# Altium schematic sheet Sheet1.SchDoc
size A4
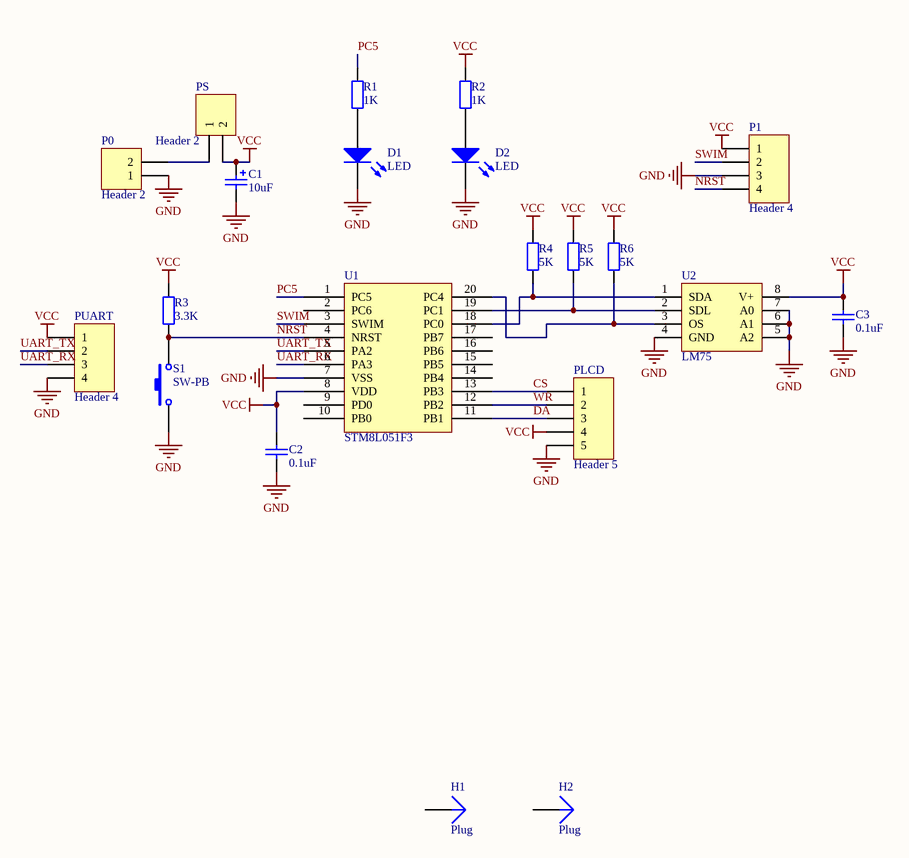
[diagram p0: Sheet1.SchDoc]

## Parts
C1  value 10uF  [CapPol5_11]  (hidden comment: Cap Pol2)
C2  value 0.1uF  [0603_LMH]  (hidden comment: Cap)
C3  value 0.1uF  [0603_LMH]  (hidden comment: Cap)
D1  LED  [0603_LMH]
D2  LED  [0603_LMH]
H1  Plug  [OriginHole]
H2  Plug  [OriginHole]
P0  Header 2  [KF350-2P]
P1  Header 4  [HDR1X4]
PLCD  Header 5  [HDR1X5]
PS  Header 2  [HDR1X2]
PUART  Header 4  [HDR1X4]
R1  value 1K  [0805]  (hidden comment: Res2)
R2  value 1K  [0805]  (hidden comment: Res2)
R3  value 3.3K  [0805]  (hidden comment: Res2)
R4  value 5K  [0805]  (hidden comment: Res2)
R5  value 5K  [0805]  (hidden comment: Res2)
R6  value 5K  [0805]  (hidden comment: Res2)
S1  SW-PB  [SW-3X6X2.5]
U1  STM8L051F3  [TSSOP20]
U2  LM75  [SOP8]

## Nets
GND: C1.2 C2.1 C3.1 D1.2(K) D2.2(K) P0.1 P1.3 PLCD.5 PUART.4 S1.1 U1.7(VSS) U2.4(GND) U2.5(A2) U2.6(A1) U2.7(A0)
VCC: C1.1 C2.2 C3.2 P1.1 PLCD.4 PS.2 PUART.1 R2.2 R3.2 R4.2 R5.2 R6.2 U1.8(VDD) U2.8(V+)
CS: PLCD.1 U1.13(PB3)
DA: PLCD.3 U1.11(PB1)
NRST: P1.4 R3.1 S1.2 U1.4(NRST)
PC5: R1.2 U1.1(PC5)
SWIM: P1.2 U1.3(SWIM)
UART_RX: PUART.3 U1.6(PA3)
UART_TX: PUART.2 U1.5(PA2)
WR: PLCD.2 U1.12(PB2)
NetD1_1: D1.1(A) R1.1
NetD2_1: D2.1(A) R2.1
NetP0_2: P0.2 PS.1
NetR4_1: R4.1 U1.18(PC0) U2.1(SDA)
NetR5_1: R5.1 U1.19(PC1) U2.2(SDL)
NetR6_1: R6.1 U1.20(PC4) U2.3(OS)

Not connected (* = marked no-connect by the designer): H1 1; H2 1; U1 2(PC6) 9(PD0) 10(PB0) 14(PB4) 15(PB5) 16(PB6) 17(PB7)

## Library data of the parts
C1 = Cap Pol2: Polarized Capacitor (Axial); Published: 8-Jun-2000; LatestRevisionDate: 17-Jul-2002; LatestRevisionNote: Re-released for DXP Platform.; PackageReference: POLAR0.8; Publisher: Altium Limited; PackageDescription: Polarized Capacitor; 2 Leads
C2 C3 = Cap: Capacitor; Published: 8-Jun-2000; LatestRevisionDate: 17-Jul-2002; LatestRevisionNote: Re-released for DXP Platform.; PackageReference: RAD-0.3; Publisher: Altium Limited; PackageDescription: Radial Cap, Thru-Hole; 2 Leads; 0.3 in Pin Spacing
D1 D2 = LED0: Typical INFRARED GaAs LED; Published: 8-Jun-2000; LatestRevisionDate: 08-Jul-2005; LatestRevisionNote: Mech Layer 1 removed.; PackageReference: LED-0; Publisher: Altium Limited; PackageDescription: LED; 2 Leads
P0 PS = Header 2: Header, 2-Pin; LatestRevisionDate: 17-Jul-2002; LatestRevisionNote: Re-released for DXP Platform.; Publisher: Altium Limited
P1 PUART = Header 4: Header, 4-Pin; LatestRevisionDate: 17-Jul-2002; LatestRevisionNote: Re-released for DXP Platform.; Publisher: Altium Limited
PLCD = Header 5: Header, 5-Pin; LatestRevisionDate: 17-Jul-2002; LatestRevisionNote: Re-released for DXP Platform.; Publisher: Altium Limited
R1-R6 = Res2: Resistor; Published: 8-Jun-2000; LatestRevisionDate: 17-Jul-2002; LatestRevisionNote: Re-released for DXP Platform.; PackageReference: AXIAL-0.4; Publisher: Altium Limited; PackageDescription: Axial Device, Thru-Hole; 2 Leads; 0.4 in Pin Spacing
S1 = SW-PB: Switch; Published: 24-Mar-1999; LatestRevisionDate: 17-Jul-2002; LatestRevisionNote: Re-released for DXP Platform.; PackageReference: SPST-2; Publisher: Altium Limited; PackageDescription: Switch; 2 Leads
H1 H2 = Plug: LatestRevisionDate: 17-Jul-2002; LatestRevisionNote: Re-released for DXP Platform.; Publisher: Altium Limited